# EAGLE design lamloei_node32s3wroom_cp2102_smf_4layers (EAGLE 7.7.0)
CNAME: LamLoei Node32S3Frame; CREVISION: R1; DESIGNER: lamloei co.,ltd.
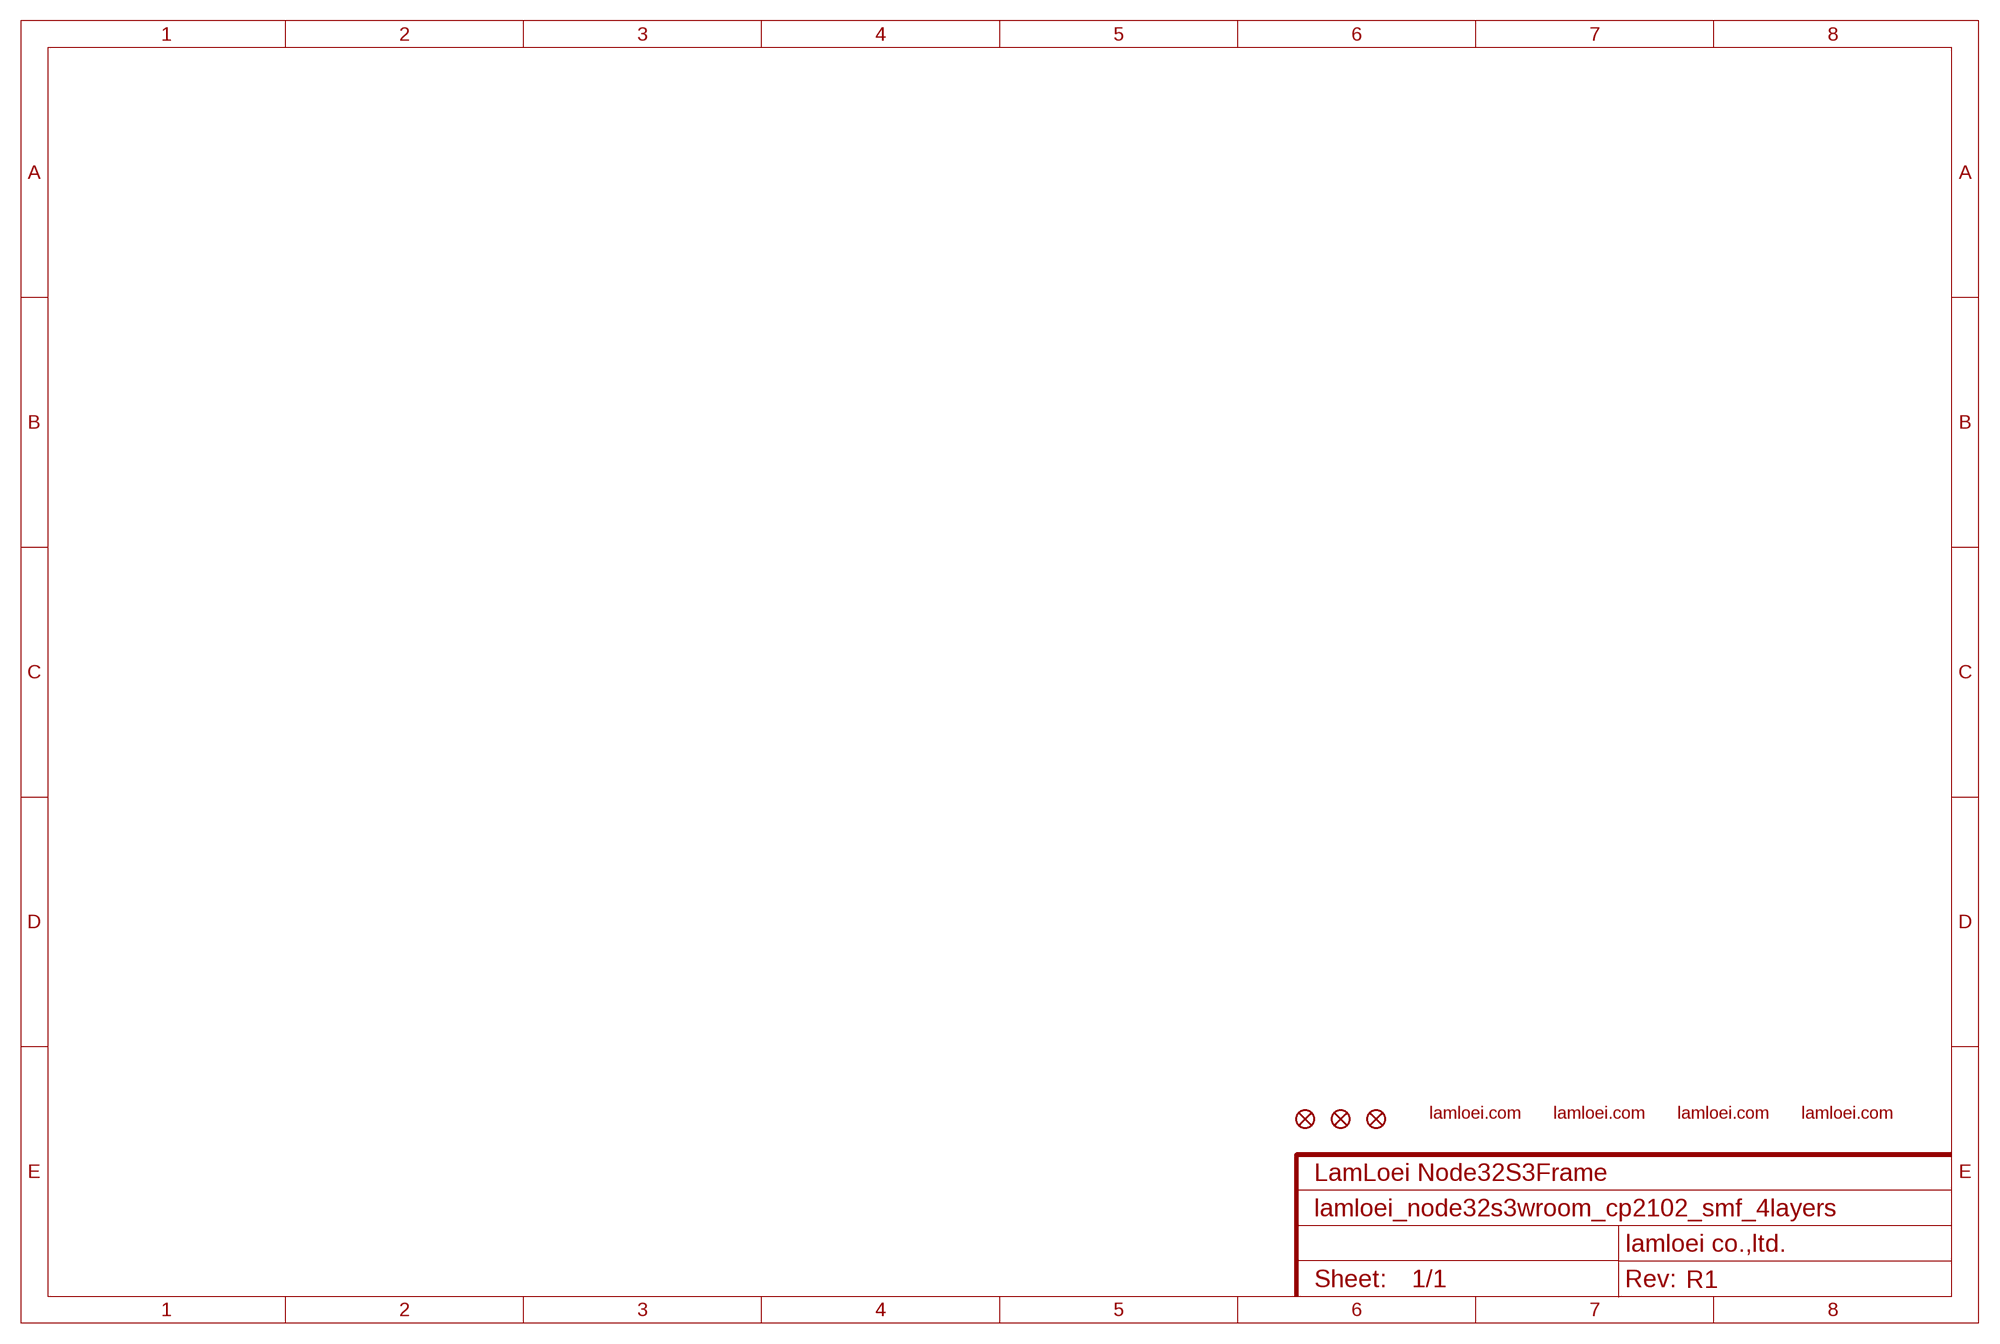
[diagram p0: schematic, sheet 1]

## Parts
ZFC1  FIDUCIAL1X2  [FIDUCIAL-1X2]
ZFC2  FIDUCIAL1X2  [FIDUCIAL-1X2]
ZFC3  FIDUCIAL1X2  [FIDUCIAL-1X2]
ZLC1  LAMLEOI_LOGO_3  [LAMLEOI_LOGO_3]
ZLC2  LAMLEOI_LOGO_3  [LAMLEOI_LOGO_3]
ZLC3  LAMLEOI_LOGO_3  [LAMLEOI_LOGO_3]
ZLC4  LAMLEOI_LOGO_3  [LAMLEOI_LOGO_3]

## Library data of the parts
ZFC1-ZFC3 = SparkFun-Aesthetics:FIDUCIAL: Fiducial Alignment Points Point-of-reference for pick-and-place machines and other optical instruments.
ZLC1-ZLC4 = lamloei_logo_3:LAMLEOI_LOGO_3: lamloei

## Board
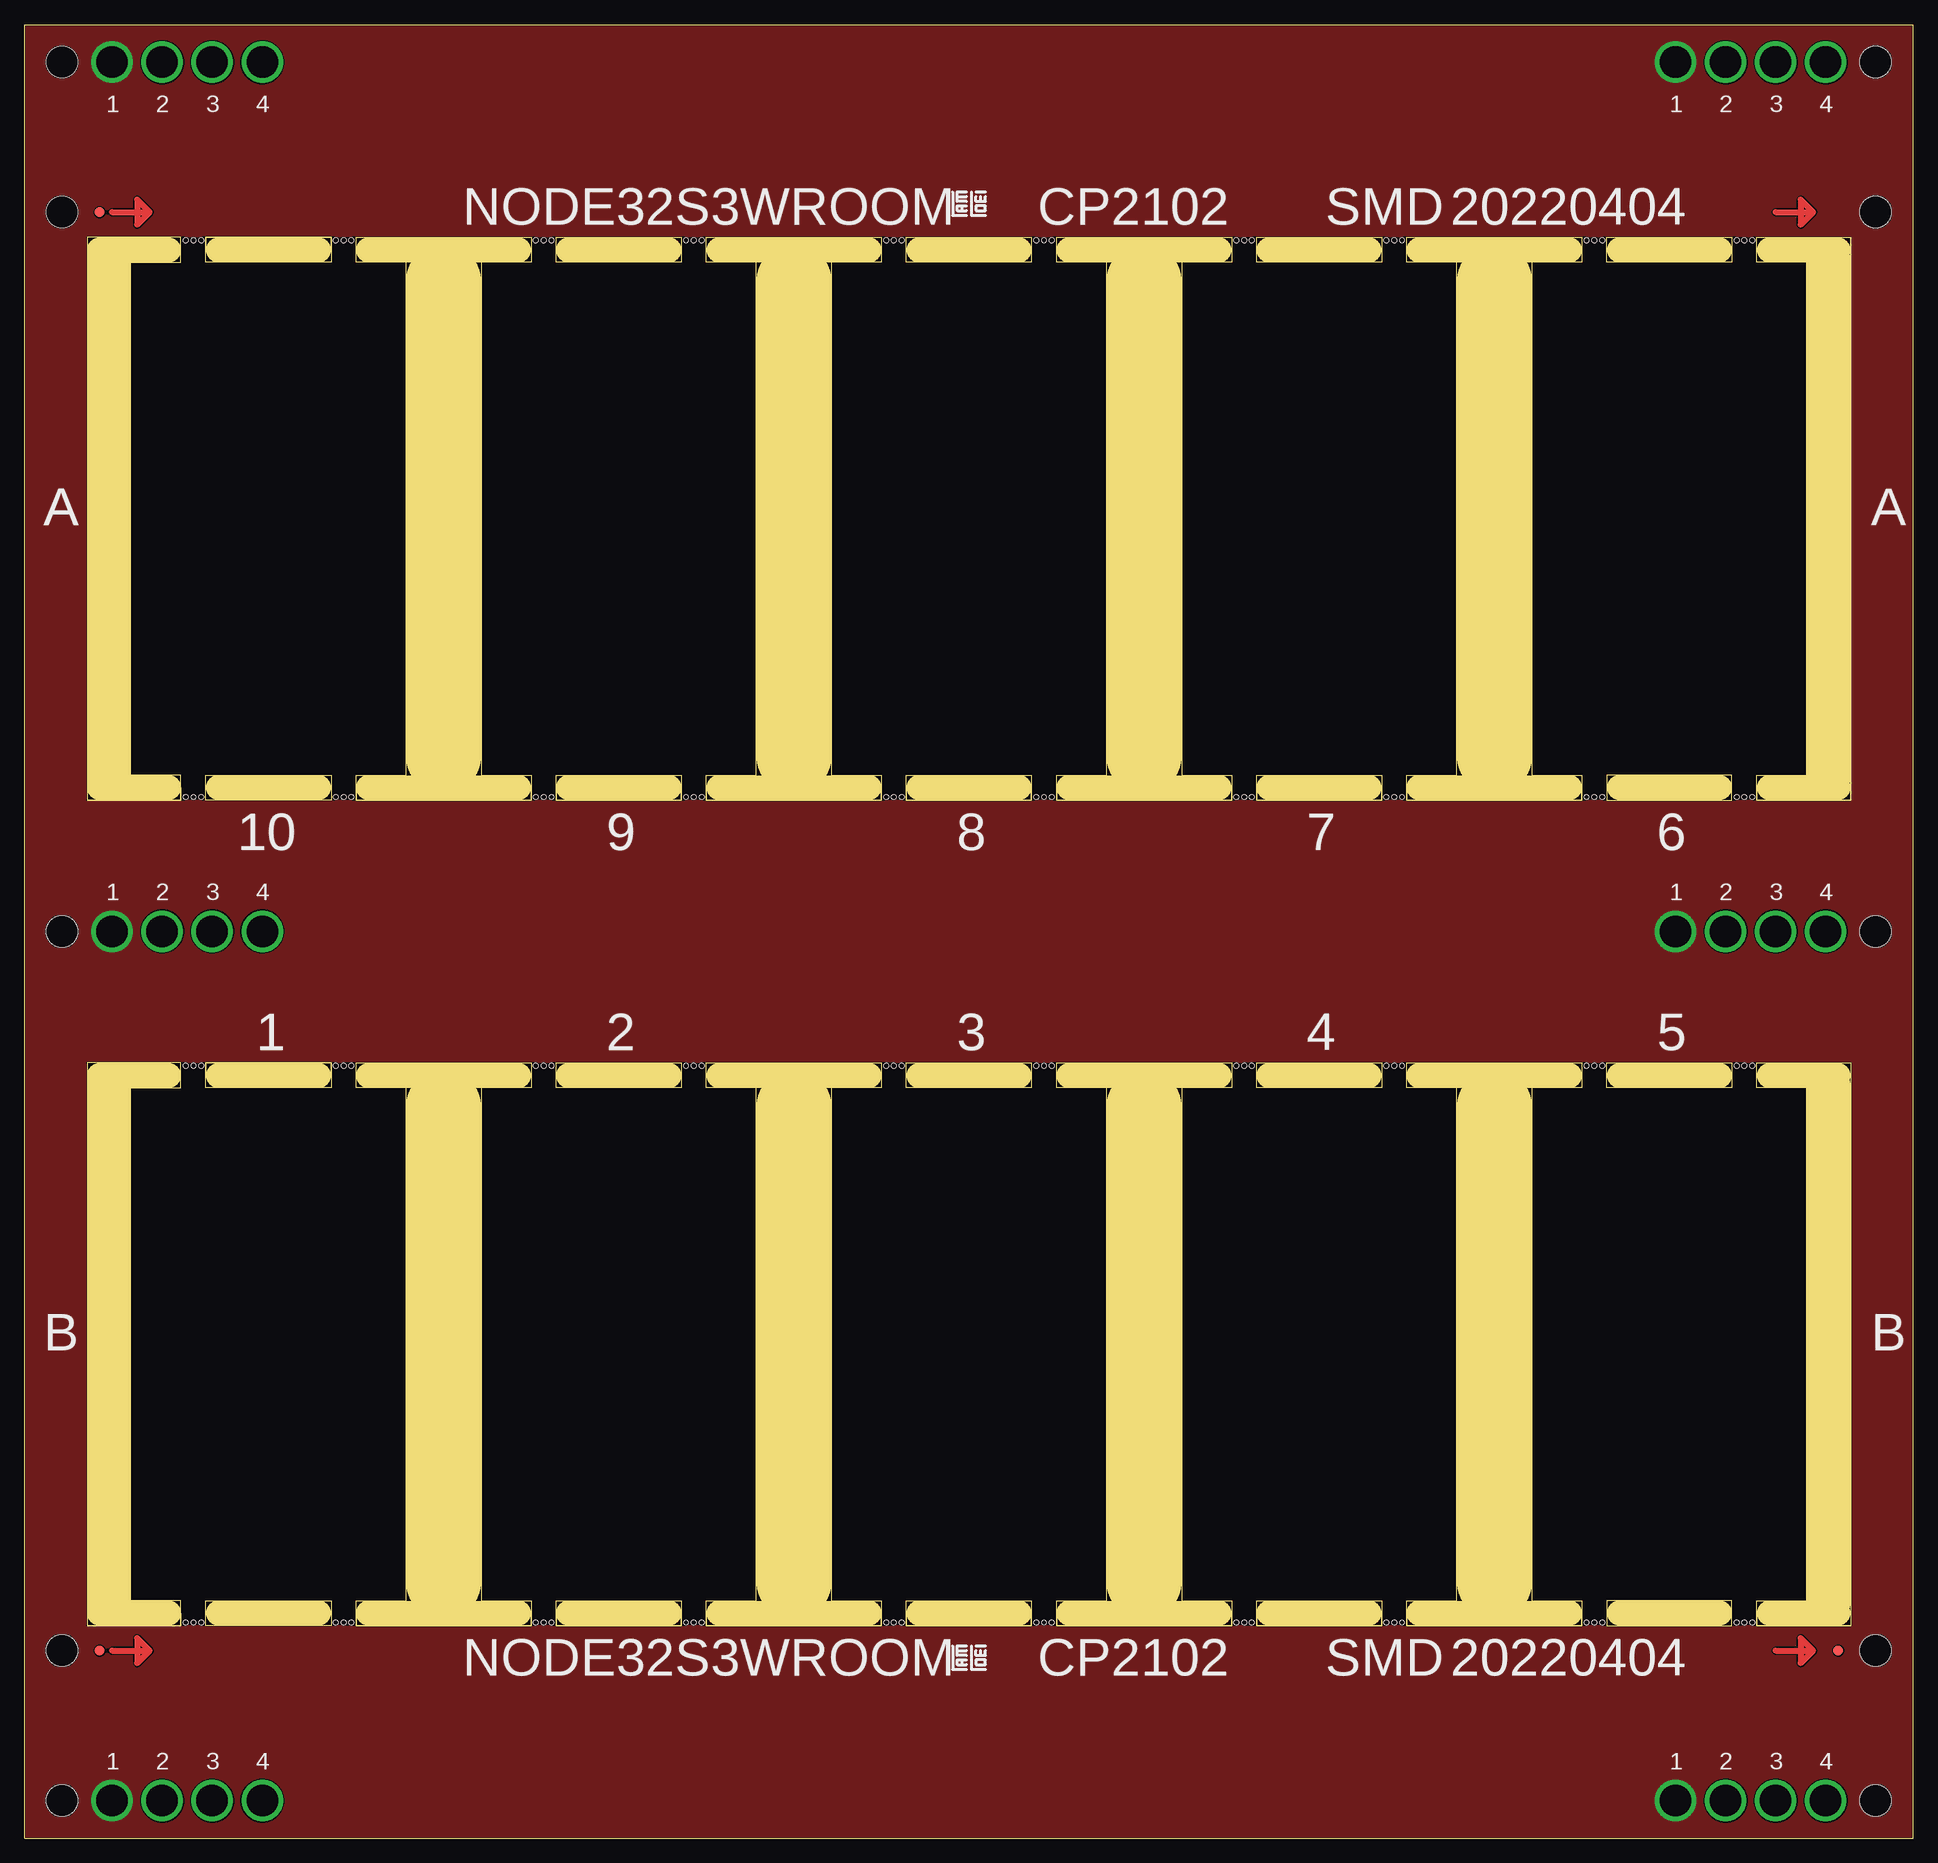
[diagram p1: board, top side]
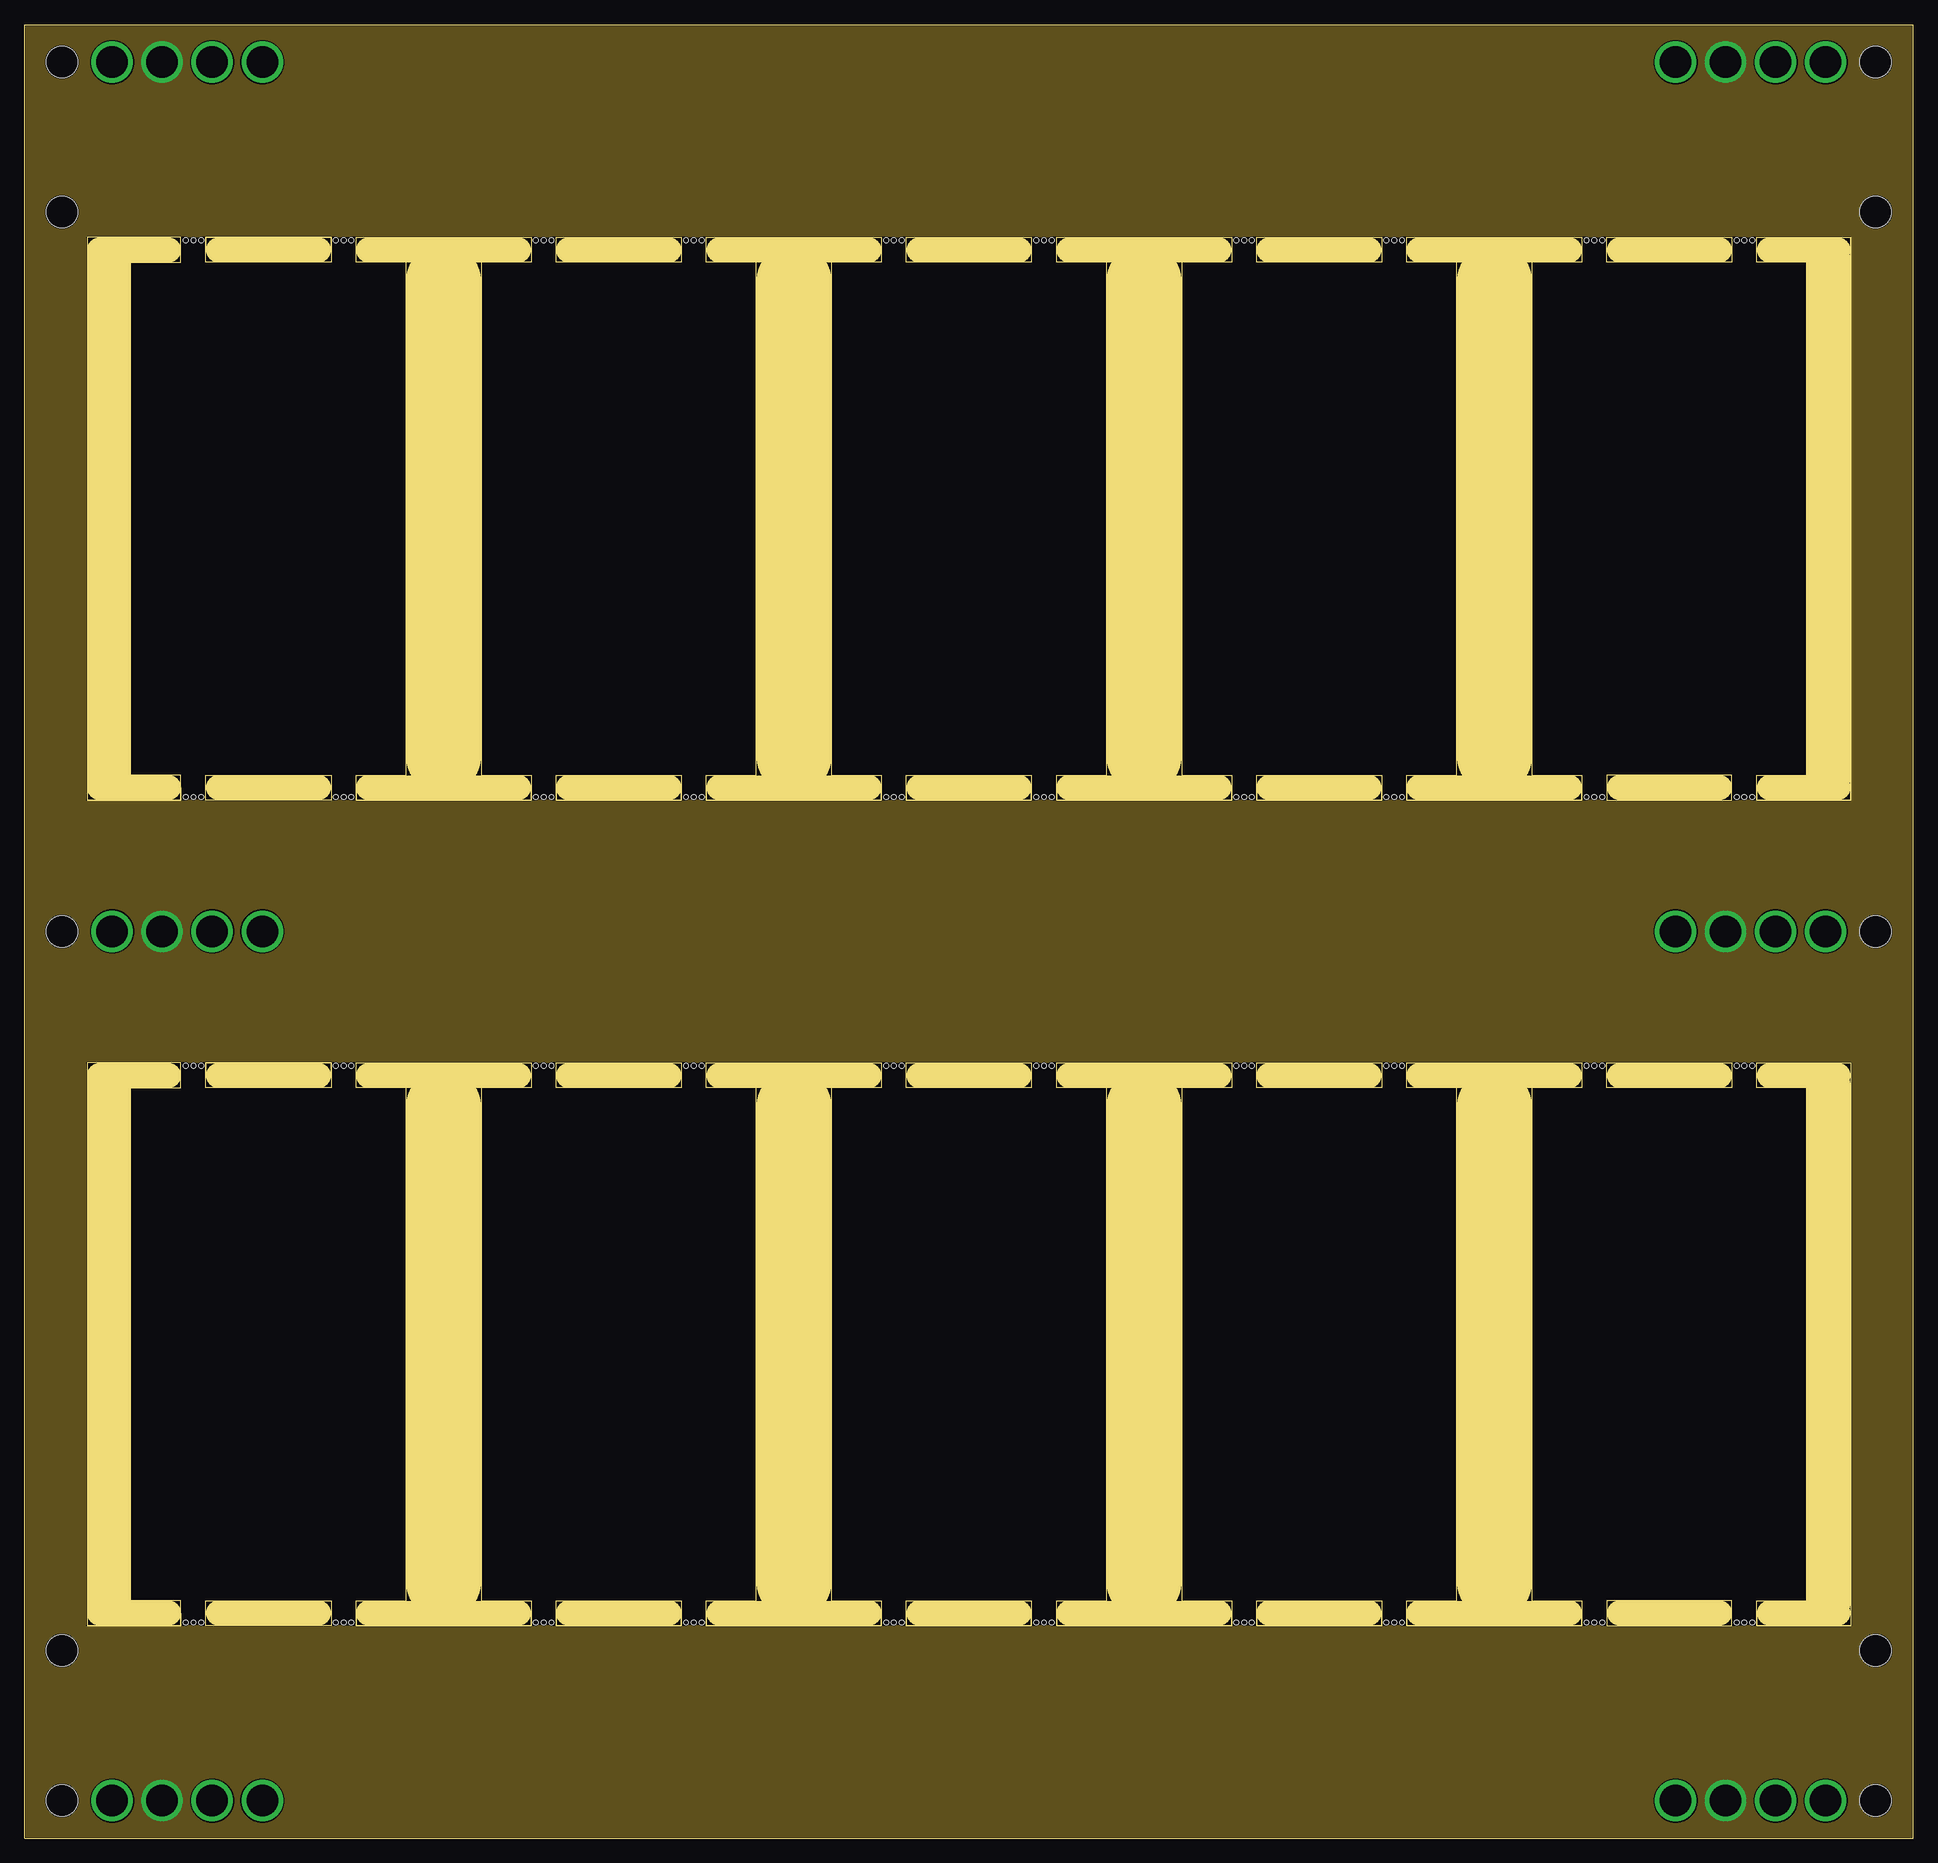
[diagram p2: board, inner layer Route2]
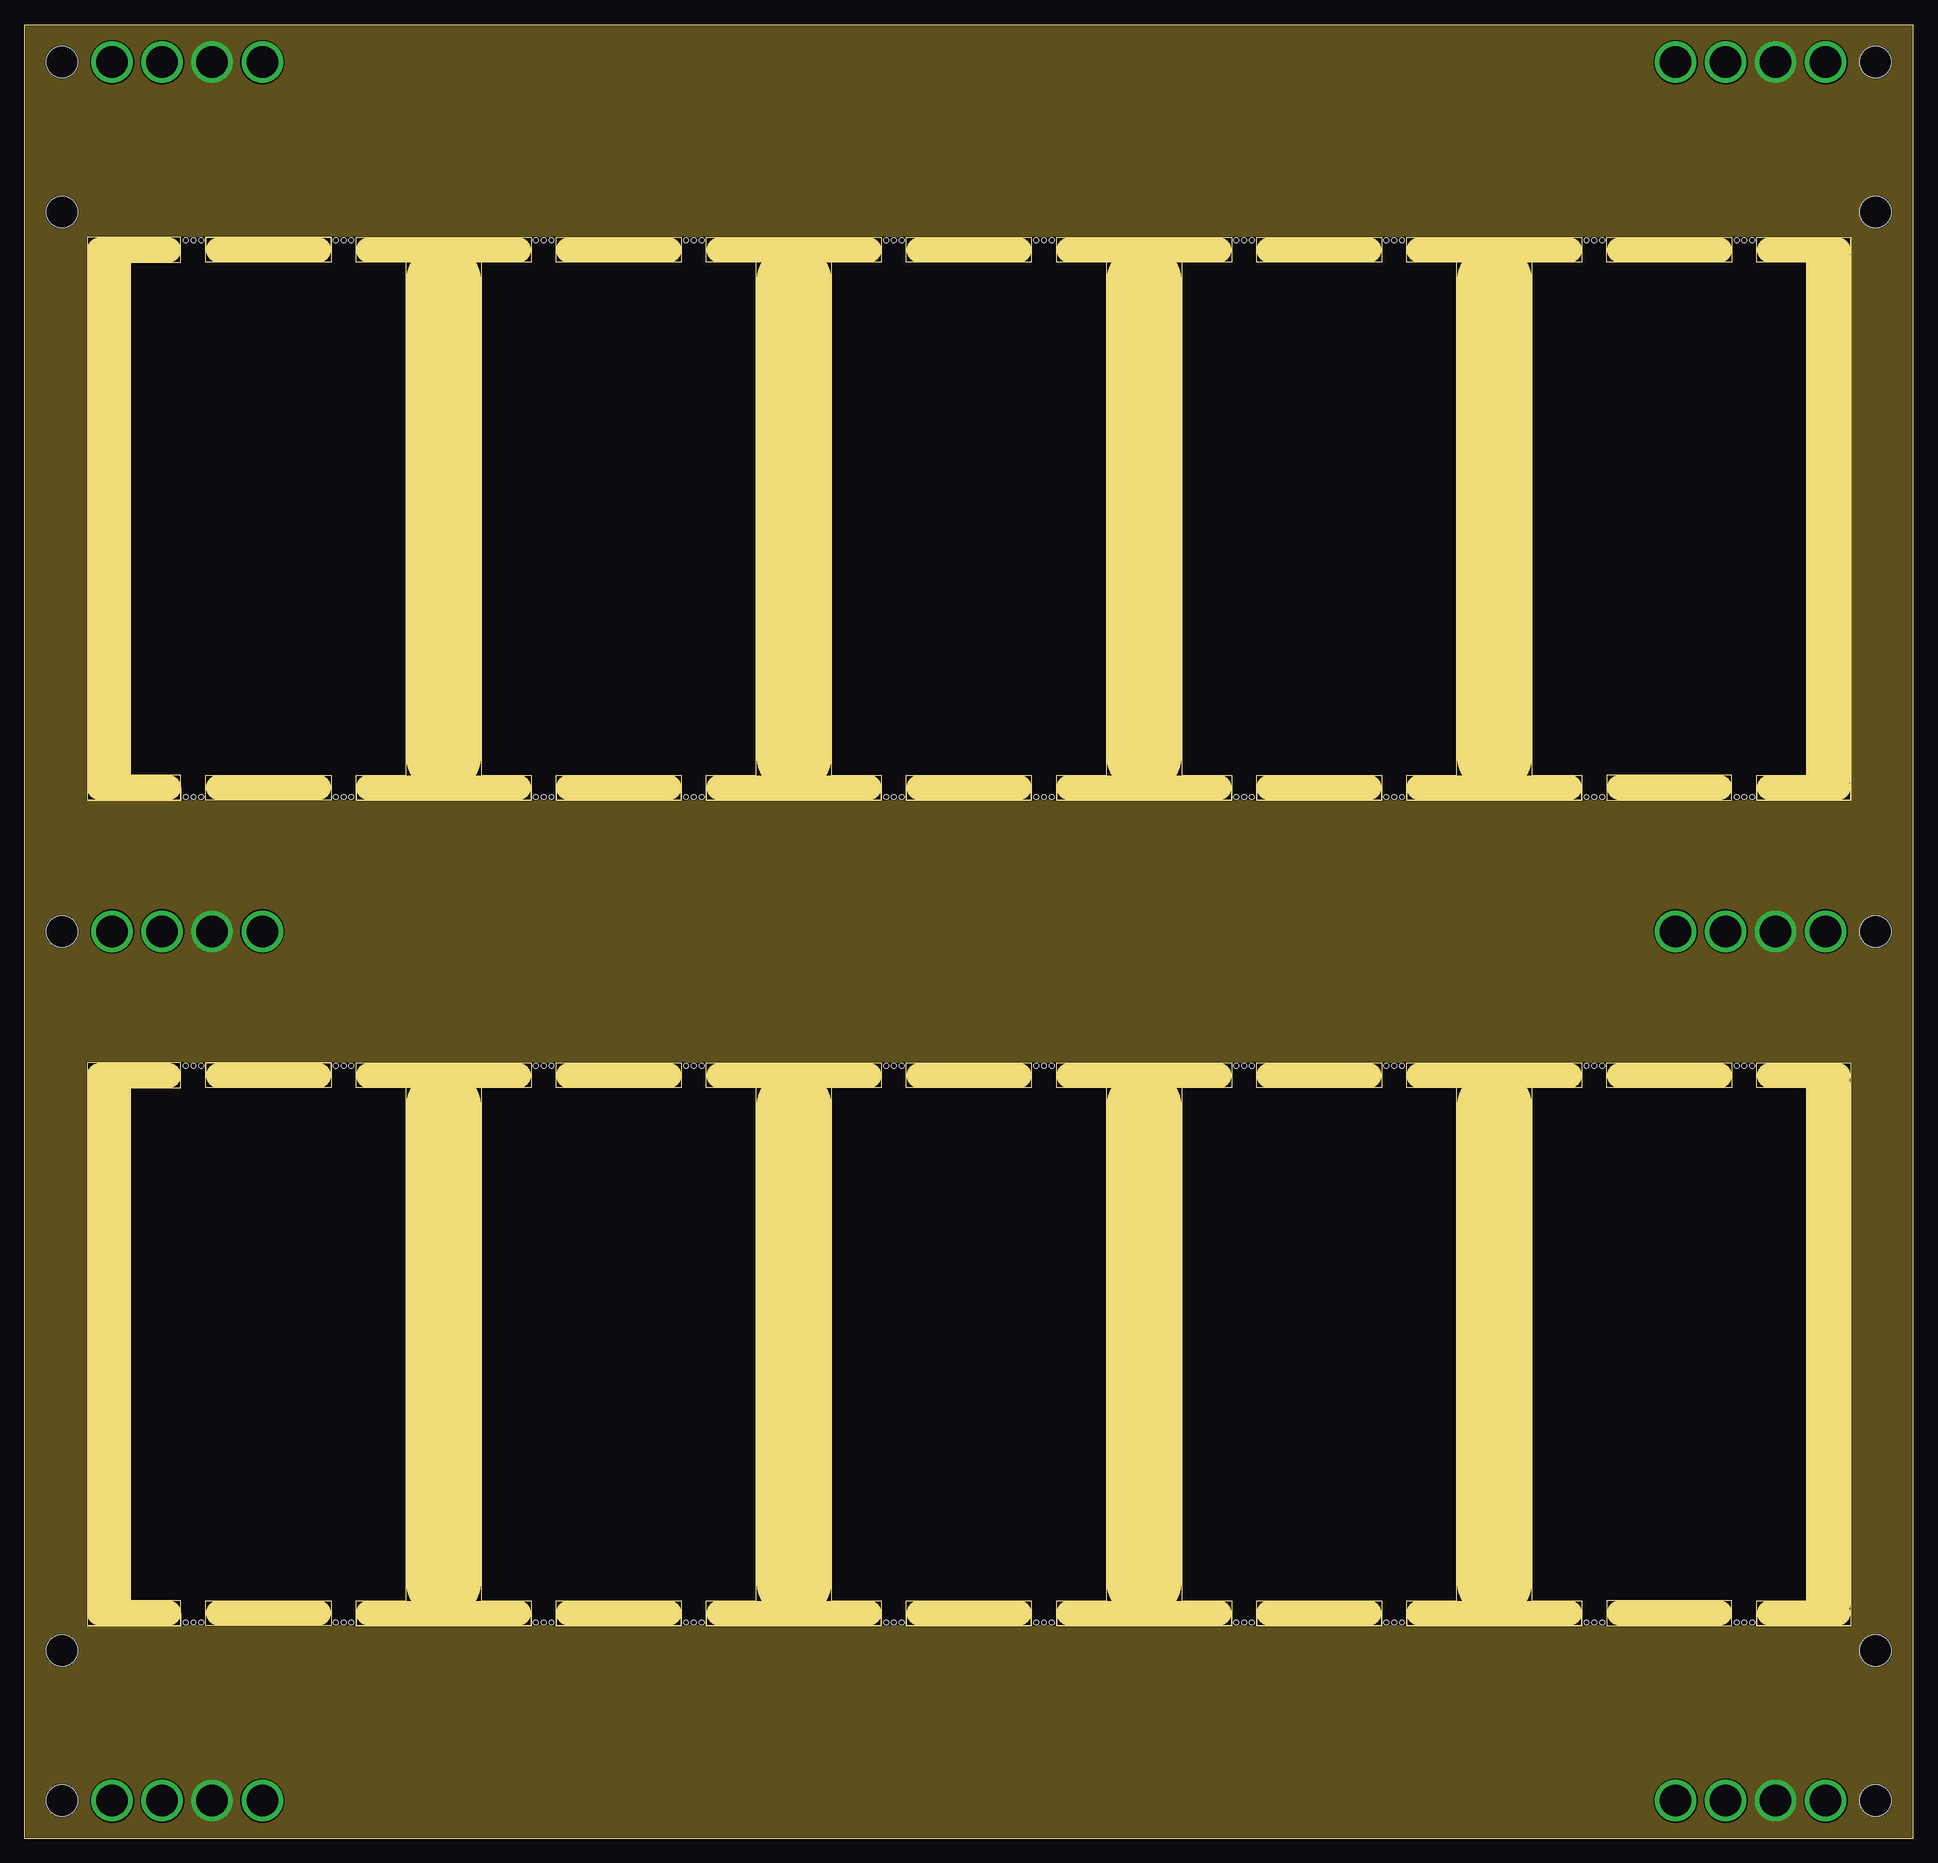
[diagram p3: board, inner layer Route15]
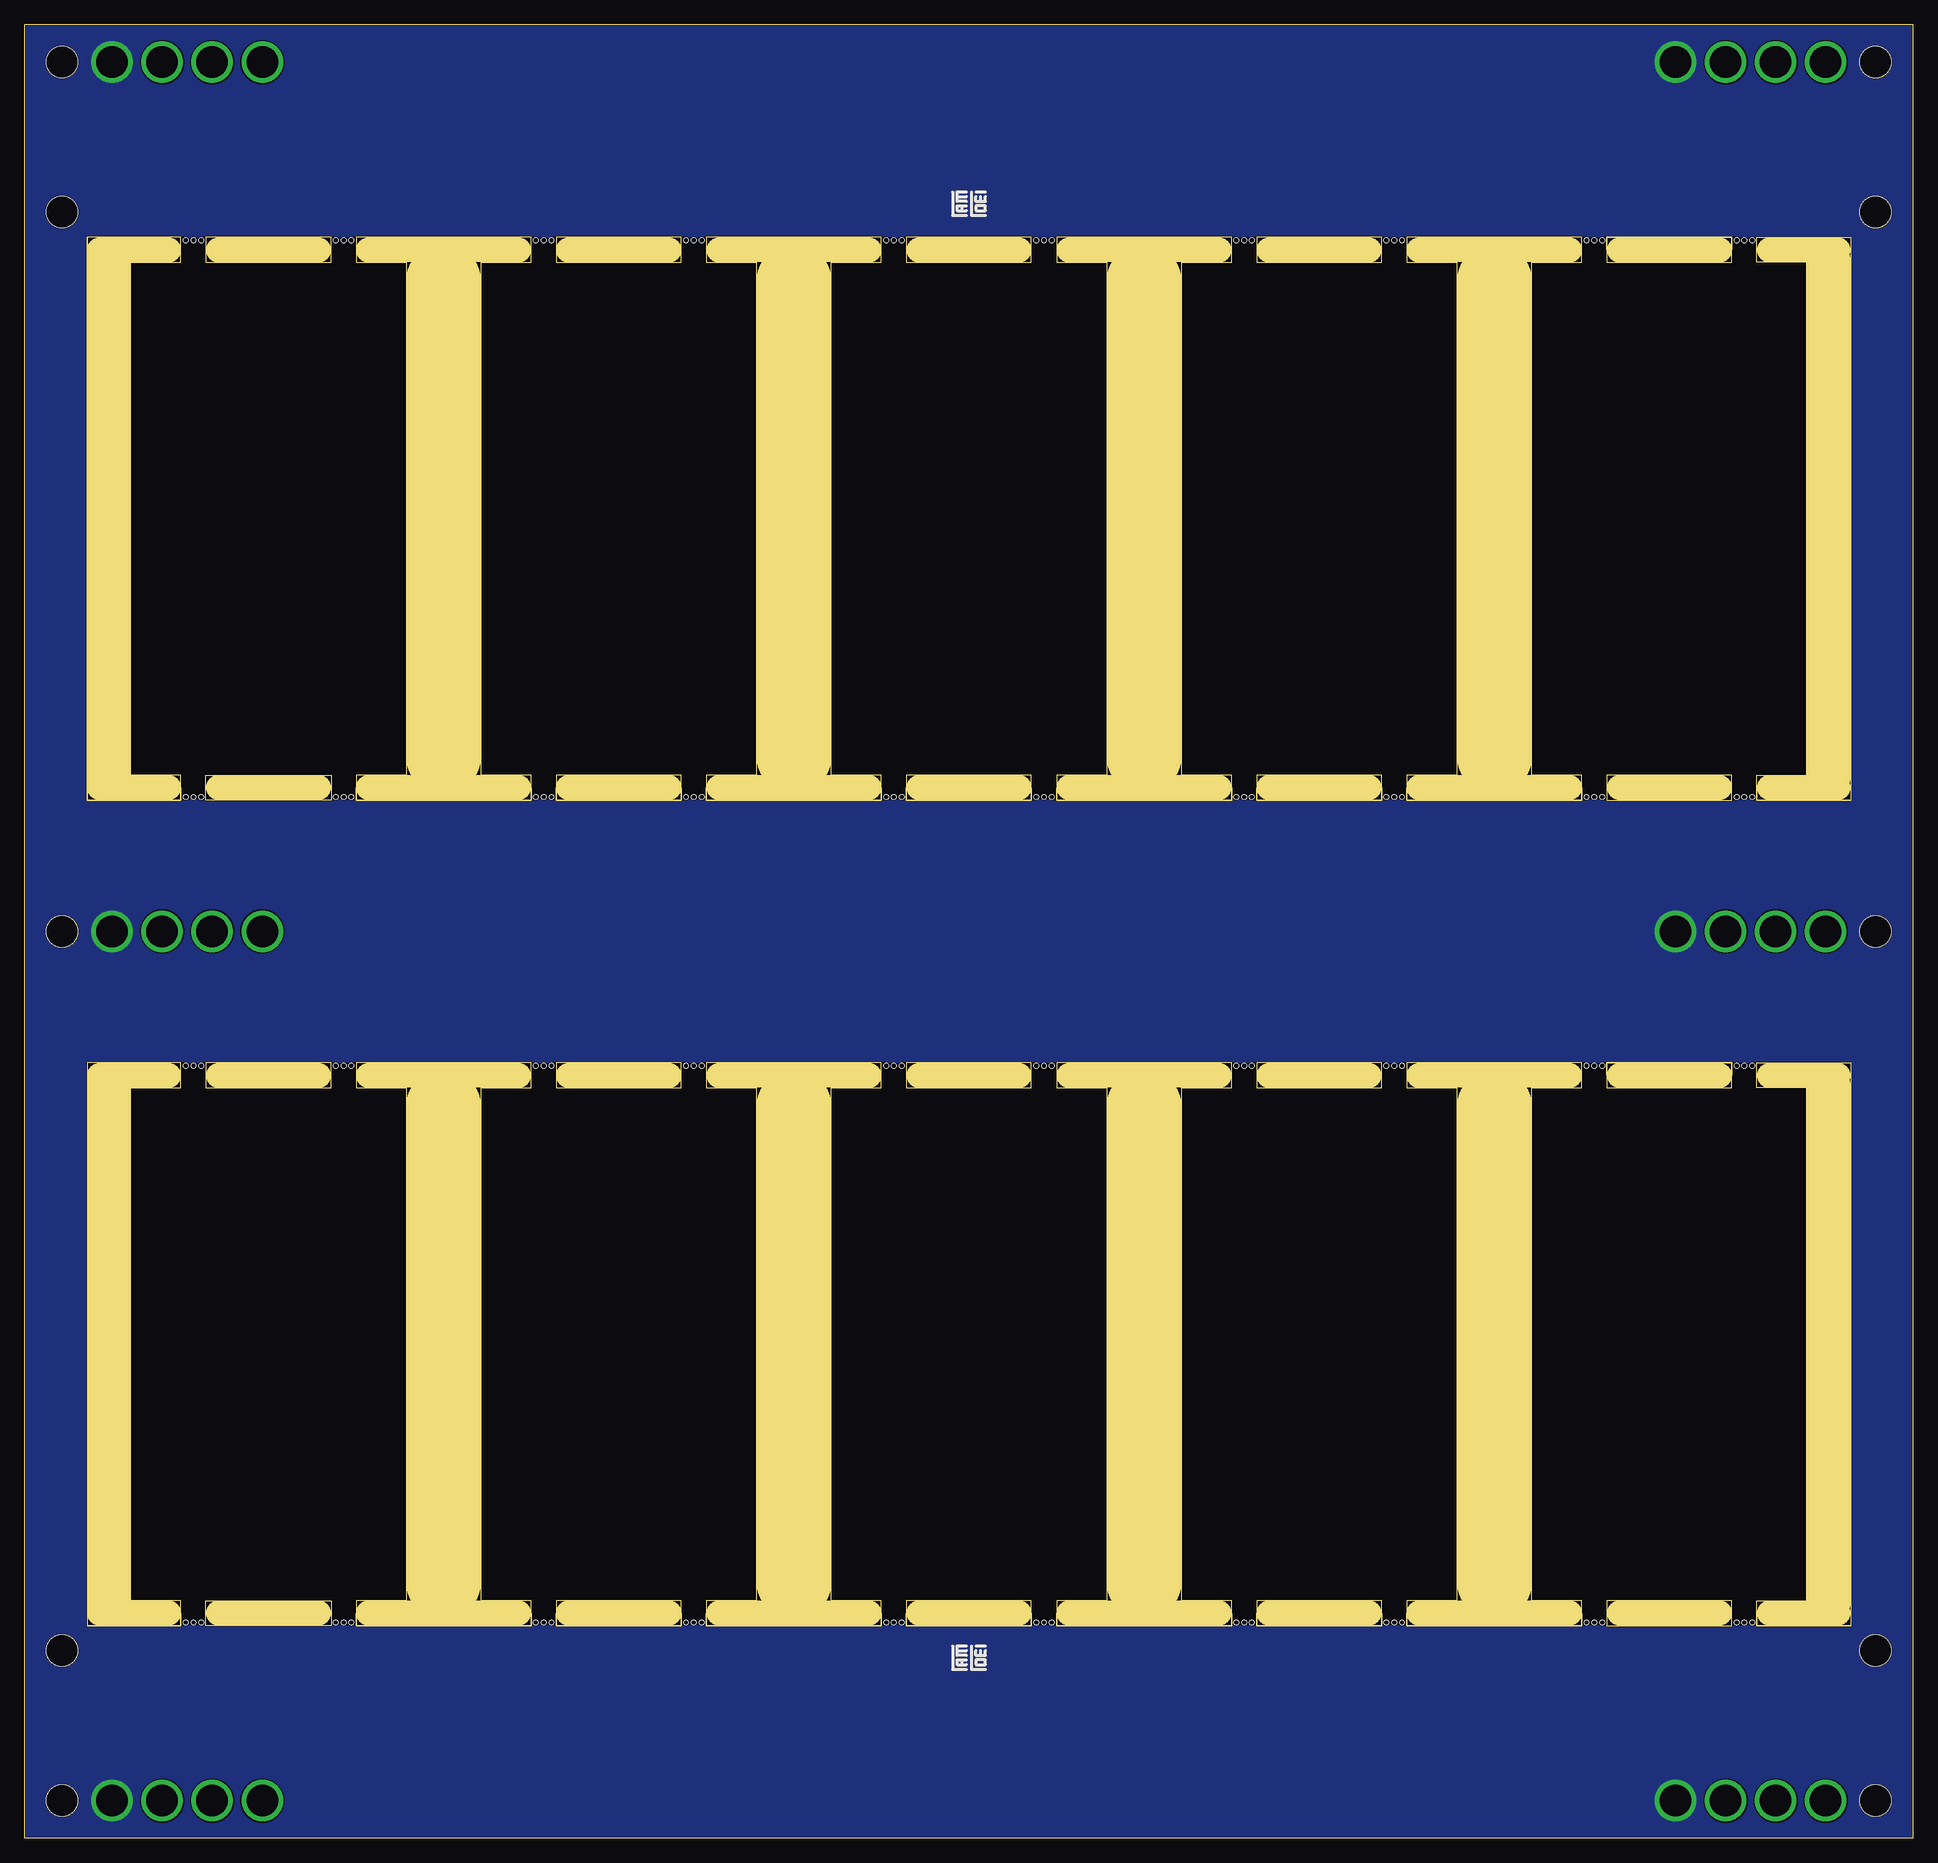
[diagram p4: board, bottom side, seen from below]

Size 191.77 x 184.15 mm. Coordinates in mm from the lower left corner, seen from the top.
Outline: 33.66,22.86 33.66,21.59 51.44,21.59 51.44,22.86
Outline: 31.11,22.86 31.11,21.59 18.41,21.59 18.41,22.86
Outline: 15.88,22.86 15.88,21.59 6.35,21.59 6.35,78.74 15.88,78.74 15.88,77.47
Outline: 53.98,22.86 53.98,21.59 66.67,21.59 66.67,22.86
Outline: 69.22,22.86 69.22,21.59 87,21.59 87,22.86
Outline: 31.11,77.47 31.11,78.74 18.41,78.74 18.41,77.47
Outline: 33.66,77.47 33.66,78.74 51.44,78.74 51.44,77.47
Outline: 53.98,77.47 53.98,78.74 66.67,78.74 66.67,77.47
Outline: 69.22,77.47 69.22,78.74 87,78.74 87,77.47
Outline: 89.53,22.86 89.53,21.59 102.23,21.59 102.23,22.86
Outline: 104.78,22.86 104.78,21.59 122.56,21.59 122.56,22.86
Outline: 89.53,77.47 89.53,78.74 102.23,78.74 102.23,77.47
Outline: 104.78,77.47 104.78,78.74 122.56,78.74 122.56,77.47
Outline: 125.09,77.47 125.09,78.74 137.79,78.74 137.79,77.47
Outline: 140.34,77.47 140.34,78.74 158.12,78.74 158.12,77.47
Outline: 160.66,77.47 160.66,78.74 173.35,78.74 173.35,77.47
Outline: 175.9,77.47 175.9,78.74 185.42,78.74 185.42,21.59 175.9,21.59 175.9,22.86
Outline: 125.09,22.86 125.09,21.59 137.79,21.59 137.79,22.86
Outline: 140.34,22.86 140.34,21.59 158.12,21.59 158.12,22.86
Outline: 160.66,22.86 160.66,21.59 173.35,21.59 173.35,22.86
Outline: 33.66,106.68 33.66,105.41 51.44,105.41 51.44,106.68
Outline: 31.11,106.68 31.11,105.41 18.41,105.41 18.41,106.68
Outline: 15.88,106.68 15.88,105.41 6.35,105.41 6.35,162.56 15.88,162.56 15.88,161.29
Outline: 53.98,106.68 53.98,105.41 66.67,105.41 66.67,106.68
Outline: 69.22,106.68 69.22,105.41 87,105.41 87,106.68
Outline: 89.53,106.68 89.53,105.41 102.23,105.41 102.23,106.68
Outline: 104.78,106.68 104.78,105.41 122.56,105.41 122.56,106.68
Outline: 125.09,106.68 125.09,105.41 137.79,105.41 137.79,106.68
Outline: 140.34,106.68 140.34,105.41 158.12,105.41 158.12,106.68
Outline: 160.66,106.68 160.66,105.41 173.35,105.41 173.35,106.68
Outline: 175.9,106.68 175.9,105.41 185.42,105.41 185.42,162.56 175.9,162.56 175.9,161.29
Outline: 31.11,161.29 31.11,162.56 18.41,162.56 18.41,161.29
Outline: 33.66,161.29 33.66,162.56 51.44,162.56 51.44,161.29
Outline: 53.98,161.29 53.98,162.56 66.67,162.56 66.67,161.29
Outline: 69.22,161.29 69.22,162.56 87,162.56 87,161.29
Outline: 89.53,161.29 89.53,162.56 102.23,162.56 102.23,161.29
Outline: 104.78,161.29 104.78,162.56 122.56,162.56 122.56,161.29
Outline: 125.09,161.29 125.09,162.56 137.79,162.56 137.79,161.29
Outline: 140.34,161.29 140.34,162.56 158.12,162.56 158.12,161.29
Outline: 160.66,161.29 160.66,162.56 173.35,162.56 173.35,161.29
Outline: 0,0 0,184.15 191.77,184.15 191.77,0 0,0
Copper layers (1*2*15*16): Top 0.035559375mm / dielectric 0.17018125mm / Route2 0.01778125mm / dielectric 47mil / Route15 0.01778125mm / dielectric 0.17018125mm / Bottom 0.035559375mm
Design rules "jlcpcb-4-layer": minimum track width 5mil, minimum drill 0.2mm, track to track 0.126490625mm, track to pad 0.126490625mm, pad to pad 0.126490625mm, via to via 0.126490625mm, smd to smd 0mil, copper to edge 0.1mm, drill to drill 5mil, minimum pad ring 4mil, minimum via ring 4mil, stop-mask expansion 3mil, vias tented up to drill 100mil, thermal gap 10mil
Holes 0.5 mm at 16.35,78.42 17.14,78.42 17.94,78.42 31.59,78.42 32.38,78.42 33.18,78.42 17.14,21.91 16.35,21.91 17.94,21.91 31.59,21.91 32.38,21.91 33.18,21.91 51.91,78.42 52.7,78.42 53.5,78.42 67.15,78.42 67.94,78.42 68.74,78.42 52.7,21.91 51.91,21.91 53.5,21.91 67.15,21.91 67.94,21.91 68.74,21.91 88.27,21.91 87.47,21.91 89.06,21.91 102.71,21.91 103.5,21.91 104.3,21.91 87.47,78.42 88.27,78.42 89.06,78.42 102.71,78.42 103.5,78.42 104.3,78.42 123.03,78.42 123.83,78.42 124.62,78.42 138.27,78.42 139.06,78.42 139.86,78.42 158.59,78.42 159.38,78.42 160.18,78.42 173.83,78.42 174.62,78.42 175.42,78.42 123.83,21.91 123.03,21.91 124.62,21.91 138.27,21.91 139.06,21.91 139.86,21.91 159.38,21.91 158.59,21.91 160.18,21.91 173.83,21.91 174.62,21.91 175.42,21.91 17.14,105.73 16.35,105.73 17.94,105.73 31.59,105.73 32.38,105.73 33.18,105.73 52.7,105.73 51.91,105.73 53.5,105.73 67.15,105.73 67.94,105.73 68.74,105.73 88.27,105.73 87.47,105.73 89.06,105.73 102.71,105.73 103.5,105.73 104.3,105.73 123.83,105.73 123.03,105.73 124.62,105.73 138.27,105.73 139.06,105.73 139.86,105.73 159.38,105.73 158.59,105.73 160.18,105.73 173.83,105.73 174.62,105.73 175.42,105.73 16.35,162.24 17.14,162.24 17.94,162.24 31.59,162.24 32.38,162.24 33.18,162.24 51.91,162.24 52.7,162.24 53.5,162.24 67.15,162.24 67.94,162.24 68.74,162.24 87.47,162.24 88.27,162.24 89.06,162.24 102.71,162.24 103.5,162.24 104.3,162.24 123.03,162.24 123.83,162.24 124.62,162.24 138.27,162.24 139.06,162.24 139.86,162.24 158.59,162.24 159.38,162.24 160.18,162.24 173.83,162.24 174.62,162.24 175.42,162.24
Holes 3.2 mm at 3.81,165.1 187.96,165.1 187.96,19.05 3.81,19.05 3.81,3.81 187.96,3.81 3.81,180.34 187.96,180.34 187.96,92.08 3.81,92.08
Milling: 264 lines

### Footprints (pad centres in the part's own frame; a part is rotated, then mirrored left to right if it is on the bottom)
FIDUCIAL-1X2 = smd 1 x 1: 1 0,0

### Placement (x,y rotation side)
ZFC1  7.62,165.1 0 top
ZFC2  7.62,19.05 0 top
ZFC3  184.15,19.05 0 top
ZLC1  93.9,164.47 0 top
ZLC2  97.87,164.47 0 bottom
ZLC3  93.9,16.83 0 top
ZLC4  97.87,16.83 0 bottom

### Tracks (layer width: path | path; a pad name or v marks a point on that pad's centre or on a via)
LAYERS_1  (via drill 3.2)
  other vias: 8.89,92.08 167.64,92.08 8.89,180.34 167.64,180.34 8.89,3.81 167.64,3.81
  pour Top: 0,0 95.81,0 95.81,21.59 6.35,21.59 6.35,78.74 185.42,78.74 185.42,21.59 95.96,21.59 95.96,0 191.77,0 191.77,184.15 95.96,184.15 95.96,162.56 185.42,162.56 185.42,105.41 6.35,105.41 6.35,162.56 95.81,162.56 95.81,184.15 0,184.15
LAYERS_2  (via drill 3.2)
  other vias: 13.97,92.08 172.72,92.08 13.97,3.81 172.72,3.81 13.97,180.34 172.72,180.34
  pour Route2: 0,0 95.81,0 95.81,21.59 6.35,21.59 6.35,78.74 185.42,78.74 185.42,21.59 95.96,21.59 95.96,0 191.77,0 191.77,184.15 95.96,184.15 95.96,162.56 185.42,162.56 185.42,105.41 6.35,105.41 6.35,162.56 95.81,162.56 95.81,184.15 0,184.15
LAYERS_3  (via drill 3.2)
  other vias: 19.05,92.08 177.8,92.08 19.05,180.34 19.05,3.81 177.8,3.81 177.8,180.34
  pour Route15: 0,0 95.81,0 95.81,21.59 6.35,21.59 6.35,78.74 185.42,78.74 185.42,21.59 95.96,21.59 95.96,0 191.77,0 191.77,184.15 95.96,184.15 95.96,162.56 185.42,162.56 185.42,105.41 6.35,105.41 6.35,162.56 95.81,162.56 95.81,184.15 0,184.15
LAYERS_4  (via drill 3.2)
  other vias: 24.13,92.08 182.88,92.08 24.13,3.81 24.13,180.34 182.88,180.34 182.88,3.81
  pour Bottom: 0,0 95.81,0 95.81,21.59 6.35,21.59 6.35,78.74 185.42,78.74 185.42,21.59 95.96,21.59 95.96,0 191.77,0 191.77,184.15 95.96,184.15 95.96,162.56 185.42,162.56 185.42,105.41 6.35,105.41 6.35,162.56 95.81,162.56 95.81,184.15 0,184.15
N$1
  Top 0.61: 8.89,165.1 12.7,165.1 | 12.7,165.1 11.43,166.37 11.43,163.83 12.7,165.1
N$2
  Top 0.61: 177.8,19.05 181.61,19.05 | 181.61,19.05 180.34,20.32 180.34,17.78 181.61,19.05
N$3
  Top 0.61: 177.8,165.1 181.61,165.1 | 181.61,165.1 180.34,166.37 180.34,163.83 181.61,165.1
N$4
  Top 0.61: 8.89,19.05 12.7,19.05 | 12.7,19.05 11.43,20.32 11.43,17.78 12.7,19.05

### Text on the board
tNames: 1 | 2 | 3 | 4 | 1 | 2 | 3 | 4 | NODE32S3WROOM | CP2102 | SMD | 20220404 | A | A | A | 10 | 9 | 8 | 7 | 6 | 1 | 2 | 3 | 4 | 1 | 2 | 3 | 4 | 1 | 2 | 3 | 4 | 5 | B | B | NODE32S3WROOM | CP2102 | SMD | 20220404 | 1 | 2 | 3 | 4 | 1 | 2 | 3 | 4